# Altium schematic sheet CCU-2-inputs.SchDoc
size A4; SheetNumber: 1; SheetTotal: 3
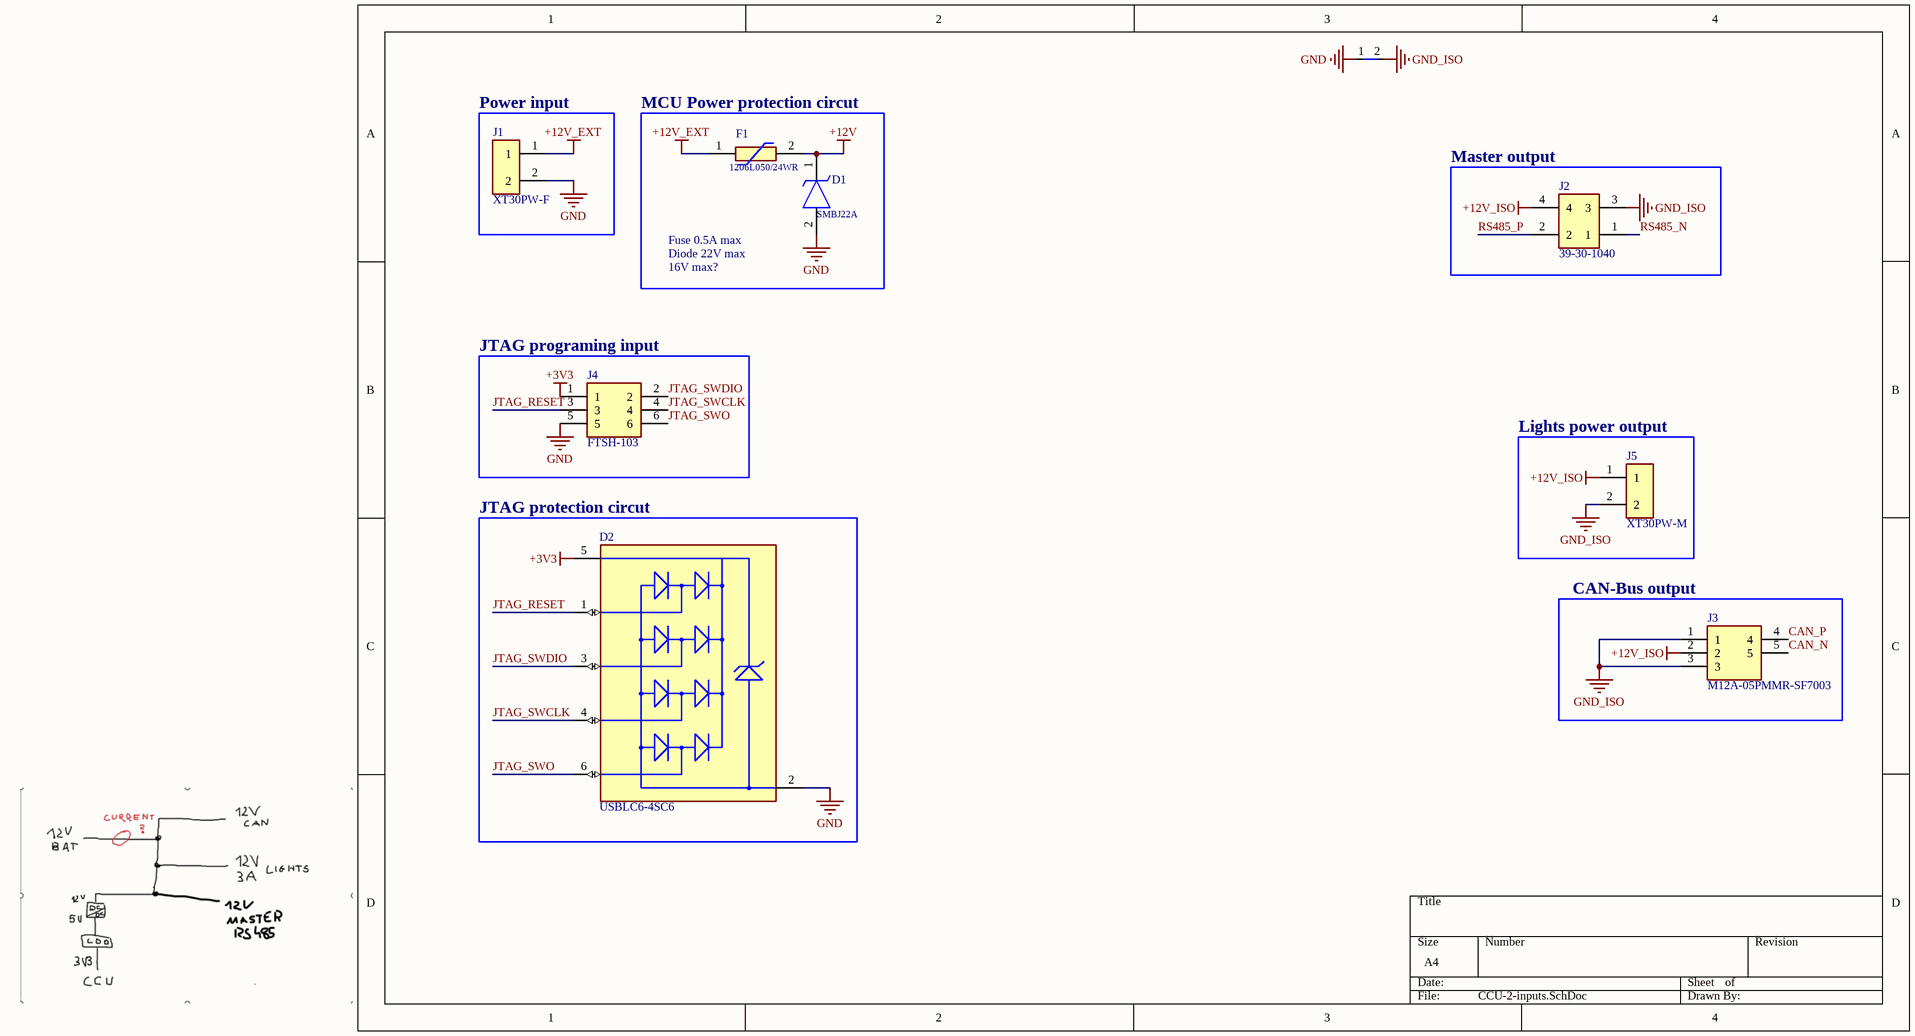
[diagram p0: CCU-2-inputs.SchDoc]

## Parts
D1  SMBJ22A  [SMBJ22A]
D2  USBLC6-4SC6  [FP-SOT23-6L-MFG]
F1  1206L050/24WR  [1206L075132WR]
J1  XT30PW-F  [XT30PWF]
J2  39-30-1040  [39-30-1040]
J3  M12A-05PMMR-SF7003  [M12A05PMMRSF7003]
J4  FTSH-103  [FP-FTSH-103-01-L-DV-TR-MFG]
J5  XT30PW-M  [XT30PWM]
NT1  NT  [NetTie_SMD]  (value not drawn)  (net tie, no BOM)

## Blocks framed on the sheet
Power input: J1
MCU Power protection circut: D1 F1
Master output: J2
JTAG programing input: J4
Lights power output: J5
JTAG protection circut: D2
CAN-Bus output: J3

## Nets
+3V3: D2.5(VBUS) J4.1
+12V: D1.1(K) F1.2
+12V_EXT: F1.1 J1.1
+12V_ISO: J2.4 J3.2 J5.1
GND: D1.2(A) D2.2(GND) J1.2 J4.5 NT1.1
GND_ISO: J2.3 J3.1 J3.3 J5.2 NT1.2
CAN_N: J3.5
CAN_P: J3.4
JTAG_RESET: D2.1(I/O1) J4.3
JTAG_SWCLK: D2.4(I/O3) J4.4
JTAG_SWDIO: D2.3(I/O2) J4.2
JTAG_SWO: D2.6(I/O4) J4.6
RS485_N: J2.1
RS485_P: J2.2

## Notes on the sheet
- Fuse 0.5A max
- Diode 22V max
- 16V max?

## Library data of the parts
D1 = SMBJ22A: Diode TVS Single Uni-Directional 22V 600W 2-Pin DO-214AA; Manufacturer: Taiwan Semiconductor; Manufacturer Lifecycle Status: ACTIVE; Breakdown Voltage: 25.7V; Clamping Voltage: 35.5V; Forward Voltage: 1V; Max Breakdown Voltage: 26.9V; Max Forward Surge Current (Ifsm): 2.5A; Max Junction Temperature (Tj): 150°C; Max Power Dissipation: 3W; Max Repetitive Reverse Voltage (Vrrm): 250V; Max Reverse Leakage Current: 1µA; Max Surge Current: 100A; Min Breakdown Voltage: 24.4V; Number of Channels: 1; Peak Pulse Current: 17.7A; Polarity: Unidirectional; Power Dissipation: 200mW; Reverse Recovery Time: 50ns; Supplier: RS; Supplier Part Number: 8022308; Manufacturer Part Number: SMBJ22A; RoHS: Compliant; Category: TVS Diodes; Stock: 500; China RoHS: Non-Compliant; Country of Origin: Mainland China, Taiwan; Export Control Classification Number (ECCN) Code: EAR99; Height: 2.44mm; Harmonized Tariff Schedule (HTS) Code: 8541.10.00.50; Introduction Date: 1998-01-21; Lead Free: Lead Free; Length: 5.59mm; Lifecycle Status: Production; Max Operating Temperature: 150°C; Min Operating Temperature: -55°C; Number of Elements: 1; Pins: 2; Number of Terminals: 2; Operating Supply Voltage: 22V; Peak Pulse Power: 600W; Peak Reverse Current: 1µA; Power Rating: 600W; REACH SVHC: No; Reverse Standoff Voltage: 22V; Schedule B: 8541100080; Voltage Rating (DC): 22V; Width: 3.94mm; ComponentLink1URL: https://datasheet.octopart.com:443/SMBJ22A-Taiwan-Semiconductor-datasheet-151942224.pdf?src-supplier=TME; ComponentLink1Description: https://datasheet.octopart.com:443/SMBJ22A-Taiwan-Semiconductor-datasheet-151942224.pdf?src-supplier=TME; ComponentLink2URL: https://datasheet.octopart.com:443/SMBJ22A-Taiwan-Semiconductor-datasheet-181551140.pdf?src-supplier=IHS; ComponentLink2Description: https://datasheet.octopart.com:443/SMBJ22A-Taiwan-Semiconductor-datasheet-181551140.pdf?src-supplier=IHS; ComponentLink3URL: https://datasheet.octopart.com:443/SMBJ22A-Taiwan-Semiconductor-datasheet-182396145.pdf?src-supplier=IHS; ComponentLink3Description: https://datasheet.octopart.com:443/SMBJ22A-Taiwan-Semiconductor-datasheet-182396145.pdf?src-supplier=IHS; ComponentLink4URL: https://datasheet.octopart.com:443/SMBJ22A-Taiwan-Semiconductor-datasheet-180789127.pdf?src-supplier=IHS; ComponentLink4Description: https://datasheet.octopart.com:443/SMBJ22A-Taiwan-Semiconductor-datasheet-180789127.pdf?src-supplier=IHS; ComponentLink5URL: https://datasheet.octopart.com:443/SMBJ22A-Taiwan-Semiconductor-datasheet-137249696.pdf?src-supplier=Taiwan+Semiconductor; ComponentLink5Description: https://datasheet.octopart.com:443/SMBJ22A-Taiwan-Semiconductor-datasheet-137249696.pdf?src-supplier=Taiwan+Semiconductor; ComponentLink6URL: https://datasheet.octopart.com:443/SMBJ22A-Taiwan-Semiconductor-datasheet-34355353.pdf?src-supplier=Taiwan+Semiconductor; ComponentLink6Description: https://datasheet.octopart.com:443/SMBJ22A-Taiwan-Semiconductor-datasheet-34355353.pdf?src-supplier=Taiwan+Semiconductor; ComponentLink7URL: https://datasheet.octopart.com:443/SMBJ22A-Taiwan-Semiconductor-datasheet-94061883.pdf?src-supplier=Newark; ComponentLink7Description: https://datasheet.octopart.com:443/SMBJ22A-Taiwan-Semiconductor-datasheet-94061883.pdf?src-supplier=Newark
D2 = CMP-2000-07370-2: TVS DIODE 5.25V 17V SOT23-6; Manufacturer: STMicroelectronics; Peak Pulse Power: 130W; Breakdown Voltage: 6V; Value: 3pF; Direction: Unidirectional; Interface: USB,Ethernet,Other; Number Of Channels: 4; Standoff Height: 0mm; Max Junction Temp: +125°C; Digikey Description: TVS DIODE 5.25V 17V SOT23-6; Automotive: No; Package: SOT23-6L; Mouser Description: USBLC6 Series 4 Line 6 V Uni / Bi-Directional ESD Protection - SOT-23-6; Octopart: https://octopart.com/usblc6-4sc6-stmicroelectronics-347147; RoHS: TRUE; ComponentLink2URL: https://upverter.com/datasheet/23dc4ffb028d868909e80577610284b194f13213.pdf; ComponentLink2Description: Datasheet; Device Class L1: Circuit Protection; Lead Free: Yes; Temperature Range High: +125°C; Device Class L2: ESD and Circuit Protection ICs; Device Class L3: unset; Capacitance: 3pF; Height: 1.45mm; Temperature Range Low: -40°C; Manufacturer Part Number: USBLC6-4SC6; Temperature: -40°C to +125°C; Category: Diode; Clamping Voltage: 17V
F1 = 1206L050/24WR: 1206L Series 24 V 500 mA 1206 SMT Polymeric PTC Resettable Fuse; Manufacturer: Littelfuse; Hold Current: 500mA; Max Current Rating: 100A; Maximum Resistance 1 Hour (R1max): 750mΩ; Minimum Resistance Initial (Rmin): 150mΩ; Power Dissipation: 600mW; Ratings: TUV; Value: 150mΩ; Trip Current: 1A; Working Voltage: 24V; Supplier: Farnell; Supplier Part Number: 1206L050/24WR; Manufacturer Part Number: 1206L050/24WR; RoHS: Compliant; Category: PTC Resettable Fuses; Stock: 540; Height: 1.25mm; Length: 3.4mm; Lifecycle Status: Production; Max Operating Temperature: 85°C; Min Operating Temperature: -40°C; Mounting Technology: Surface Mount; Number of Terminals: 2; REACH SVHC: Yes; Width: 1.8mm; ComponentLink1URL: https://datasheet.octopart.com:443/1206L050-24WR-Littelfuse-datasheet-181956355.pdf?src-supplier=IHS; ComponentLink1Description: https://datasheet.octopart.com:443/1206L050-24WR-Littelfuse-datasheet-181956355.pdf?src-supplier=IHS; ComponentLink2URL: https://datasheet.octopart.com:443/1206L050-24WR-Littelfuse-datasheet-165518606.pdf?src-supplier=Newark; ComponentLink2Description: https://datasheet.octopart.com:443/1206L050-24WR-Littelfuse-datasheet-165518606.pdf?src-supplier=Newark; ComponentLink3URL: https://datasheet.octopart.com:443/1206L050-24WR-Littelfuse-datasheet-130008768.pdf?src-supplier=ODG+(Origin+Data+Global); ComponentLink3Description: https://datasheet.octopart.com:443/1206L050-24WR-Littelfuse-datasheet-130008768.pdf?src-supplier=ODG+(Origin+Data+Global); ComponentLink4URL: https://datasheet.octopart.com:443/1206L050-24WR-Littelfuse-datasheet-183575726.pdf?src-supplier=Sager+Electronics; ComponentLink4Description: https://datasheet.octopart.com:443/1206L050-24WR-Littelfuse-datasheet-183575726.pdf?src-supplier=Sager+Electronics; ComponentLink5URL: https://datasheet.octopart.com:443/1206L050-24WR-Littelfuse-datasheet-176144932.pdf?src-supplier=Sager+Electronics; ComponentLink5Description: https://datasheet.octopart.com:443/1206L050-24WR-Littelfuse-datasheet-176144932.pdf?src-supplier=Sager+Electronics; ComponentLink6URL: https://datasheet.octopart.com:443/1206L050-24WR-Littelfuse-datasheet-178296428.pdf?src-supplier=Burklin+Elektronik; ComponentLink6Description: https://datasheet.octopart.com:443/1206L050-24WR-Littelfuse-datasheet-178296428.pdf?src-supplier=Burklin+Elektronik; ComponentLink7URL: https://datasheet.octopart.com:443/1206L050-24WR-Littelfuse-datasheet-170674161.pdf?src-supplier=Future+Electronics; ComponentLink7Description: https://datasheet.octopart.com:443/1206L050-24WR-Littelfuse-datasheet-170674161.pdf?src-supplier=Future+Electronics; ComponentLink8URL: https://datasheet.octopart.com:443/1206L050-24WR-Littelfuse-datasheet-26530142.pdf?src-supplier=Fuses+Unlimited; ComponentLink8Description: https://datasheet.octopart.com:443/1206L050-24WR-Littelfuse-datasheet-26530142.pdf?src-supplier=Fuses+Unlimited; Supplier 1: Farnell; Supplier Part Number 1: 1206L050/24WR
J1 = XT30PW-F: Socket; DC supply; XT30; female; PIN:2; on PCBs; THT; Colour: yellow; Manufacturer_Name: Amass; Geometry.Height: 5mm; Manufacturer_Part_Number: XT30PW-F; Mouser Part Number: *; Mouser Price/Stock: *; Arrow Part Number: *; Arrow Price/Stock: *; Datasheet Link: https://www.tme.eu/Document/ce4077e36b79046da520ca73227e15de/XT30PW%20SPEC.pdf
J2 = 39-30-1040: Molex Connector 2x2 4.2mm Solder Right Angle Thru-Hole Tray; Manufacturer Lifecycle Status: ACTIVE; Approvals: CSA, TUV, UL; Connector Type: Power, Rectangular; Contact Resistance: 10mΩ; Current Rating: 9A; Gender: Male; Glow Wire Compliant: Non-compliant; Insulation Resistance: 1GΩ; Number of Circuits: 3; Number of Contacts: 4; Plating Thickness: 2.54µm; Ratings: CSA, TUV; Voltage Rating: 600V; Supplier: DigiKey; Supplier Part Number: WM1352-ND; Manufacturer: Molex; Manufacturer Part Number: 39-30-1040; RoHS: Compliant; Category: Headers and Wire Housings; Stock: 5632; Pricing: 1=0,85, 10=0,72, 100=0,6122, 500=0,54636, 4000=0,47179, 8000=0,44928, 12000=0,43662 (USD); China RoHS: Compliant; Color: Natural; Contact Gender: Male; Contact Material: Brass; Contact Plating: Tin; Country of Origin: US; Depth: 19.79mm; Export Control Classification Number (ECCN) Code: EAR99; ELV: Compliant; Flammability Rating: UL94 V-2; Halogen Free: Low Halogen; Height: 13.38mm; Housing Material: Nylon; Harmonized Tariff Schedule (HTS) Code: 8536.69.40.30; Introduction Date: 1994-12-01; Lead Free: Lead Free; Lead Pitch: 4.2mm; Length: 21.08mm; Lifecycle Status: Production; Material: Nylon; Max Operating Temperature: 105°C; Min Operating Temperature: -40°C; Mounting Technology: PCB, Through Hole; Pins: 5; Number of Poles: 4; Number of Positions: 4; Number of Rows: 1; Orientation: Right Angle, Vertical; Packaging: Bulk; Pitch: 4.2mm; Radiation Hardening: No; REACH SVHC: Yes; Row Spacing: 4.2mm; Schedule B: 8536694040, 8536694040|8536694040, 8536694040|8536694040|8536694040, 8536694040|8536694040|8536694040|8536694040; Termination: Solder; Voltage Rating (AC): 600V; Voltage Rating (DC): 600V; Working Voltage: 600V; ComponentLink1URL: https://datasheet.octopart.com:443/39-30-1040-Molex-datasheet-138897372.pdf?src-supplier=Upverter; ComponentLink1Description: https://datasheet.octopart.com:443/39-30-1040-Molex-datasheet-138897372.pdf?src-supplier=Upverter; ComponentLink2URL: https://datasheet.octopart.com:443/039301040-Molex-datasheet-8338717.pdf?src-supplier=Upverter; ComponentLink2Description: https://datasheet.octopart.com:443/039301040-Molex-datasheet-8338717.pdf?src-supplier=Upverter; ComponentLink3URL: https://sigma.octopart.com:443/120074128/technical_drawing/Molex-39-30-1040.pdf?src-supplier=IHS; ComponentLink3Description: https://sigma.octopart.com:443/120074128/technical_drawing/Molex-39-30-1040.pdf?src-supplier=IHS; ComponentLink4URL: https://datasheet.octopart.com:443/39-30-1040-Molex-datasheet-12525736.pdf?src-supplier=Molex; ComponentLink4Description: https://datasheet.octopart.com:443/39-30-1040-Molex-datasheet-12525736.pdf?src-supplier=Molex; ComponentLink5URL: https://sigma.octopart.com:443/15644801/technical_drawing/Molex-39-30-1040.pdf?src-supplier=Molex; ComponentLink5Description: https://sigma.octopart.com:443/15644801/technical_drawing/Molex-39-30-1040.pdf?src-supplier=Molex; ComponentLink6URL: https://datasheet.octopart.com:443/39-30-1040-Molex-datasheet-193097287.pdf?src-supplier=JRH+Electronics; ComponentLink6Description: https://datasheet.octopart.com:443/39-30-1040-Molex-datasheet-193097287.pdf?src-supplier=JRH+Electronics; ComponentLink7URL: https://datasheet.octopart.com:443/39-30-1040-Molex-datasheet-154749335.pdf?src-supplier=Master+Electronics; ComponentLink7Description: https://datasheet.octopart.com:443/39-30-1040-Molex-datasheet-154749335.pdf?src-supplier=Master+Electronics; ComponentLink8URL: https://datasheet.octopart.com:443/39-30-1040-Molex-datasheet-101582408.pdf?src-supplier=Farnell; ComponentLink8Description: https://datasheet.octopart.com:443/39-30-1040-Molex-datasheet-101582408.pdf?src-supplier=Farnell; ComponentLink9URL: https://datasheet.octopart.com:443/39-30-1040-Molex-datasheet-13726788.pdf?src-supplier=Farnell; ComponentLink9Description: https://datasheet.octopart.com:443/39-30-1040-Molex-datasheet-13726788.pdf?src-supplier=Farnell; ComponentLink10URL: https://datasheet.octopart.com:443/39-30-1040-Molex-datasheet-8451564.pdf?src-supplier=Farnell; ComponentLink10Description: https://datasheet.octopart.com:443/39-30-1040-Molex-datasheet-8451564.pdf?src-supplier=Farnell; ComponentLink11URL: https://datasheet.octopart.com:443/39-30-1040-Molex-datasheet-8377082.pdf?src-supplier=Farnell; ComponentLink11Description: https://datasheet.octopart.com:443/39-30-1040-Molex-datasheet-8377082.pdf?src-supplier=Farnell; ComponentLink12URL: https://datasheet.octopart.com:443/39-30-1040-Molex-datasheet-8338264.pdf?src-supplier=Farnell; ComponentLink12Description: https://datasheet.octopart.com:443/39-30-1040-Molex-datasheet-8338264.pdf?src-supplier=Farnell; ComponentLink13URL: https://datasheet.octopart.com:443/39-30-1040-Molex-datasheet-21539009.pdf?src-supplier=Electro+Sonic; ComponentLink13Description: https://datasheet.octopart.com:443/39-30-1040-Molex-datasheet-21539009.pdf?src-supplier=Electro+Sonic; ComponentLink14URL: https://datasheet.octopart.com:443/39-30-1040-Molex-datasheet-62104196.pdf?src-supplier=Electro+Sonic; ComponentLink14Description: https://datasheet.octopart.com:443/39-30-1040-Molex-datasheet-62104196.pdf?src-supplier=Electro+Sonic; ComponentLink15URL: https://datasheet.octopart.com:443/39-30-1040-Molex-datasheet-37170052.pdf?src-supplier=Electro+Sonic; ComponentLink15Description: https://datasheet.octopart.com:443/39-30-1040-Molex-datasheet-37170052.pdf?src-supplier=Electro+Sonic; ComponentLink16URL: https://datasheet.octopart.com:443/39-30-1040-Molex-datasheet-140183172.pdf?src-supplier=RS+(Formerly+Allied+Electronics); ComponentLink16Description: https://datasheet.octopart.com:443/39-30-1040-Molex-datasheet-140183172.pdf?src-supplier=RS+(Formerly+Allied+Electronics); ComponentLink17URL: https://datasheet.octopart.com:443/39-30-1040-Molex-datasheet-120148725.pdf?src-supplier=RS+(Formerly+Allied+Electronics); ComponentLink17Description: https://datasheet.octopart.com:443/39-30-1040-Molex-datasheet-120148725.pdf?src-supplier=RS+(Formerly+Allied+Electronics); ComponentLink18URL: https://datasheet.octopart.com:443/39-30-1040-Molex-datasheet-34442213.pdf?src-supplier=RS+(Formerly+Allied+Electronics); ComponentLink18Description: https://datasheet.octopart.com:443/39-30-1040-Molex-datasheet-34442213.pdf?src-supplier=RS+(Formerly+Allied+Electronics); ComponentLink19URL: https://datasheet.octopart.com:443/39-30-1040-Molex-datasheet-9746676.pdf?src-supplier=RS+(Formerly+Allied+Electronics); ComponentLink19Description: https://datasheet.octopart.com:443/39-30-1040-Molex-datasheet-9746676.pdf?src-supplier=RS+(Formerly+Allied+Electronics); ComponentLink20URL: https://datasheet.octopart.com:443/39-30-1040-Molex-datasheet-156091076.pdf?src-supplier=Jameco; ComponentLink20Description: https://datasheet.octopart.com:443/39-30-1040-Molex-datasheet-156091076.pdf?src-supplier=Jameco; ComponentLink21URL: https://datasheet.octopart.com:443/39301040-Molex-datasheet-7831653.pdf?src-supplier=Jameco; ComponentLink21Description: https://datasheet.octopart.com:443/39301040-Molex-datasheet-7831653.pdf?src-supplier=Jameco; ComponentLink22URL: https://datasheet.octopart.com:443/39-30-1040-Molex-datasheet-7265007.pdf?src-supplier=Jameco; ComponentLink22Description: https://datasheet.octopart.com:443/39-30-1040-Molex-datasheet-7265007.pdf?src-supplier=Jameco; ComponentLink23URL: https://datasheet.octopart.com:443/39-30-1040-Molex-datasheet-33002872.pdf?src-supplier=Newark; ComponentLink23Description: https://datasheet.octopart.com:443/39-30-1040-Molex-datasheet-33002872.pdf?src-supplier=Newark; ComponentLink24URL: https://datasheet.octopart.com:443/39-30-1040-Molex-datasheet-21207484.pdf?src-supplier=Newark; ComponentLink24Description: https://datasheet.octopart.com:443/39-30-1040-Molex-datasheet-21207484.pdf?src-supplier=Newark; ComponentLink25URL: https://datasheet.octopart.com:443/39-30-1040-Molex-datasheet-2405.pdf?src-supplier=Newark; ComponentLink25Description: https://datasheet.octopart.com:443/39-30-1040-Molex-datasheet-2405.pdf?src-supplier=Newark; ComponentLink26URL: https://datasheet.octopart.com:443/39-30-1040-Molex-datasheet-21395541.pdf?src-supplier=TME; ComponentLink26Description: https://datasheet.octopart.com:443/39-30-1040-Molex-datasheet-21395541.pdf?src-supplier=TME; ComponentLink27URL: https://datasheet.octopart.com:443/39-30-1040-Molex-datasheet-134310.pdf?src-supplier=DigiKey; ComponentLink27Description: https://datasheet.octopart.com:443/39-30-1040-Molex-datasheet-134310.pdf?src-supplier=DigiKey; ComponentLink28URL: http://sigma.octopart.com:80/15645375/rohs_certificate/Molex-39-30-1040.pdf?src-supplier=Compliance+Statements; ComponentLink28Description: http://sigma.octopart.com:80/15645375/rohs_certificate/Molex-39-30-1040.pdf?src-supplier=Compliance+Statements; ComponentLink29URL: http://sigma.octopart.com:80/reach_statement/Molex-company-74.pdf?src-supplier=Compliance+Statements; ComponentLink29Description: http://sigma.octopart.com:80/reach_statement/Molex-company-74.pdf?src-supplier=Compliance+Statements; ComponentLink30URL: http://sigma.octopart.com:80/rohs_statement/Molex-company-73.pdf?src-supplier=Compliance+Statements; ComponentLink30Description: http://sigma.octopart.com:80/rohs_statement/Molex-company-73.pdf?src-supplier=Compliance+Statements; ComponentLink31URL: http://sigma.octopart.com:80/conflict_mineral_statement/Molex-company-72.pdf?src-supplier=Compliance+Statements; ComponentLink31Description: http://sigma.octopart.com:80/conflict_mineral_statement/Molex-company-72.pdf?src-supplier=Compliance+Statements
J3 = M12A-05PMMR-SF7003: M12, A Code, 4A, 05 pins, Male Contact, Hexagonal, M12*1.0, PCB 90ø, Front Fastened, IP67; Manufacturer_Name: Amphenol; Manufacturer: Amphenol LTW; Geometry.Height: 15mm; Connector Type: Signal; Number of Positions: 5; Voltage Rating: 60V; Manufacturer_Part_Number: M12A-05PMMR-SF7003; Mouser Part Number: 523-M12A05PMMRSF7003; Mouser Price/Stock: https://www.mouser.co.uk/ProductDetail/Amphenol-LTW/M12A-05PMMR-SF7003?qs=f9yNj16SXrIdWSE1H9dLLQ%3D%3D; Arrow Part Number: M12A-05PMMR-SF7003; Arrow Price/Stock: https://www.arrow.com/en/products/m12a-05pmmr-sf7003/amphenol?utm_currency=USD&region=nac; Datasheet Link: https://amphenolltw.com/down.php?prod_files=605433; Supplier: Avnet; Supplier Part Number: 50AC2957; Manufacturer Part Number: M12A-05PMMR-SF7003; RoHS: Compliant; Category: Circular Connectors; Stock: 32; Current Rating: 4A; Gender: Male; Lifecycle Status: Production; Pins: 5; ComponentLink1URL: https://datasheet.octopart.com:443/M12A-05PMMR-SF7003-Amphenol-datasheet-182346588.pdf?src-supplier=IHS; ComponentLink1Description: https://datasheet.octopart.com:443/M12A-05PMMR-SF7003-Amphenol-datasheet-182346588.pdf?src-supplier=IHS; ComponentLink2URL: https://datasheet.octopart.com:443/M12A-05PMMR-SF7003-Amphenol-LTW-datasheet-184719079.pdf?src-supplier=TME; ComponentLink2Description: https://datasheet.octopart.com:443/M12A-05PMMR-SF7003-Amphenol-LTW-datasheet-184719079.pdf?src-supplier=TME; ComponentLink3URL: https://datasheet.octopart.com:443/M12A-05PMMR-SF7003-Amphenol-LTW-datasheet-180194516.pdf?src-supplier=JRH+Electronics; ComponentLink3Description: https://datasheet.octopart.com:443/M12A-05PMMR-SF7003-Amphenol-LTW-datasheet-180194516.pdf?src-supplier=JRH+Electronics
J4 = FTSH-103-01-L-DV-TR: Pin Header, Board-to-Board, Wire-to-Board, 1.27 mm, 2 Rows, 6 Contacts, Surface Mount, FTSH; Manufacturer: Samtec; Manufacturer Lifecycle Status: PRODUCTION; Current Rating: 3.4A; Gender: Male; Max Current Rating: 1.75A; Number of Contacts: 6; Pitch: 1.27mm; Supplier: RS; Supplier Part Number: 1802874; Manufacturer Part Number: FTSH-103-01-L-DV-TR; RoHS: Compliant; Category: Headers and Wire Housings; Stock: 1; Contact Material: Gold, Nickel; Contact Plating: Gold; Depth: 3.43mm; Height: 6.23mm; Housing Color: Black; Housing Material: Polymer; Lead Free: Lead Free; Length: 3.81mm; Lifecycle Status: Production; Max Operating Temperature: 125°C; Min Operating Temperature: -55°C; Pins: 6; Number of Rows: 2; Packaging: Tape and Reel; Radiation Hardening: No; REACH SVHC: No; Termination: Solder; ComponentLink1URL: https://sigma.octopart.com:443/152766371/technical_drawing/Samtec-FTSH-103-01-L-DV-TR.pdf?src-supplier=Upverter; ComponentLink1Description: https://sigma.octopart.com:443/152766371/technical_drawing/Samtec-FTSH-103-01-L-DV-TR.pdf?src-supplier=Upverter; ComponentLink2URL: https://sigma.octopart.com:443/97029548/technical_drawing/Samtec-FTSH-103-01-L-DV-TR.pdf?src-supplier=Electro+Sonic; ComponentLink2Description: https://sigma.octopart.com:443/97029548/technical_drawing/Samtec-FTSH-103-01-L-DV-TR.pdf?src-supplier=Electro+Sonic; ComponentLink3URL: https://datasheet.octopart.com:443/FTSH-103-01-L-DV-TR-Samtec-datasheet-97029545.pdf?src-supplier=Samtec; ComponentLink3Description: https://datasheet.octopart.com:443/FTSH-103-01-L-DV-TR-Samtec-datasheet-97029545.pdf?src-supplier=Samtec; ComponentLink4URL: https://datasheet.octopart.com:443/FTSH-103-01-L-DV-TR-Samtec-datasheet-140825048.pdf?src-supplier=Master+Electronics; ComponentLink4Description: https://datasheet.octopart.com:443/FTSH-103-01-L-DV-TR-Samtec-datasheet-140825048.pdf?src-supplier=Master+Electronics; ComponentLink5URL: https://datasheet.octopart.com:443/FTSH-103-01-L-DV-TR-Samtec-datasheet-137003348.pdf?src-supplier=Master+Electronics; ComponentLink5Description: https://datasheet.octopart.com:443/FTSH-103-01-L-DV-TR-Samtec-datasheet-137003348.pdf?src-supplier=Master+Electronics; ComponentLink6URL: https://datasheet.octopart.com:443/FTSH-103-01-L-DV-TR-Samtec-datasheet-62087996.pdf?src-supplier=element14+APAC; ComponentLink6Description: https://datasheet.octopart.com:443/FTSH-103-01-L-DV-TR-Samtec-datasheet-62087996.pdf?src-supplier=element14+APAC; ComponentLink7URL: https://datasheet.octopart.com:443/FTSH-103-01-L-DV-TR-Samtec-datasheet-86818370.pdf?src-supplier=Sager+Electronics; ComponentLink7Description: https://datasheet.octopart.com:443/FTSH-103-01-L-DV-TR-Samtec-datasheet-86818370.pdf?src-supplier=Sager+Electronics; ComponentLink8URL: https://datasheet.octopart.com:443/FTSH-103-01-L-DV-TR-Samtec-datasheet-151470459.pdf?src-supplier=Sager+Electronics; ComponentLink8Description: https://datasheet.octopart.com:443/FTSH-103-01-L-DV-TR-Samtec-datasheet-151470459.pdf?src-supplier=Sager+Electronics; ComponentLink9URL: https://datasheet.octopart.com:443/FTSH-103-01-L-DV-TR-Samtec-datasheet-151470458.pdf?src-supplier=Sager+Electronics; ComponentLink9Description: https://datasheet.octopart.com:443/FTSH-103-01-L-DV-TR-Samtec-datasheet-151470458.pdf?src-supplier=Sager+Electronics; ComponentLink10URL: https://datasheet.octopart.com:443/FTSH-103-01-L-DV-TR-Samtec-datasheet-33007713.pdf?src-supplier=Farnell; ComponentLink10Description: https://datasheet.octopart.com:443/FTSH-103-01-L-DV-TR-Samtec-datasheet-33007713.pdf?src-supplier=Farnell; ComponentLink11URL: https://datasheet.octopart.com:443/FTSH-103-01-L-DV-TR-Samtec-datasheet-183475175.pdf?src-supplier=JRH+Electronics; ComponentLink11Description: https://datasheet.octopart.com:443/FTSH-103-01-L-DV-TR-Samtec-datasheet-183475175.pdf?src-supplier=JRH+Electronics; ComponentLink12URL: https://datasheet.octopart.com:443/FTSH-103-01-L-DV-TR-Samtec-datasheet-176663386.pdf?src-supplier=Toby+Electronics; ComponentLink12Description: https://datasheet.octopart.com:443/FTSH-103-01-L-DV-TR-Samtec-datasheet-176663386.pdf?src-supplier=Toby+Electronics; ComponentLink13URL: https://datasheet.octopart.com:443/FTSH-103-01-L-DV-TR-Samtec-datasheet-133497664.pdf?src-supplier=Toby+Electronics; ComponentLink13Description: https://datasheet.octopart.com:443/FTSH-103-01-L-DV-TR-Samtec-datasheet-133497664.pdf?src-supplier=Toby+Electronics; ComponentLink14URL: https://datasheet.octopart.com:443/FTSH-103-01-L-DV-TR-Samtec-datasheet-116535196.pdf?src-supplier=Toby+Electronics; ComponentLink14Description: https://datasheet.octopart.com:443/FTSH-103-01-L-DV-TR-Samtec-datasheet-116535196.pdf?src-supplier=Toby+Electronics; ComponentLink15URL: https://datasheet.octopart.com:443/FTSH-103-01-L-DV-TR-Samtec-datasheet-138897704.pdf?src-supplier=HQonline; ComponentLink15Description: https://datasheet.octopart.com:443/FTSH-103-01-L-DV-TR-Samtec-datasheet-138897704.pdf?src-supplier=HQonline; ComponentLink16URL: https://datasheet.octopart.com:443/FTSH-103-01-L-DV-TR-Samtec-datasheet-11553404.pdf?src-supplier=Arrow+Electronics; ComponentLink16Description: https://datasheet.octopart.com:443/FTSH-103-01-L-DV-TR-Samtec-datasheet-11553404.pdf?src-supplier=Arrow+Electronics; Supplier 1: RS; Supplier Part Number 1: 1802874; Supplier 2: RS; Supplier Part Number 2: 1976473
J5 = XT30PW-M: Plug; XT30; Male; 30A; Low Temperature Rise Fire Retardant; Manufacturer_Name: Amass; Geometry.Height: 5mm; Manufacturer_Part_Number: XT30PW-M; Mouser Part Number: *; Mouser Price/Stock: *; Arrow Part Number: *; Arrow Price/Stock: *; Datasheet Link: https://www.tme.eu/sl/Document/ce4077e36b79046da520ca73227e15de/XT30PW%20SPEC.pdf; ComponentLink1URL: https://datasheet.octopart.com/XT30PW-M-Amass-datasheet-165556440.pdf?src-supplier=TME; ComponentLink1Description: https://datasheet.octopart.com/XT30PW-M-Amass-datasheet-165556440.pdf?src-supplier=TME
NT1 = NetTie_SMD: Net Tie SMD